# Altium schematic sheet RCJ_OnStage2024_FC_mcu.SchDoc
size 891 x 420 mm; SheetNumber: 1; SheetTotal: 4; SheetSize: А3
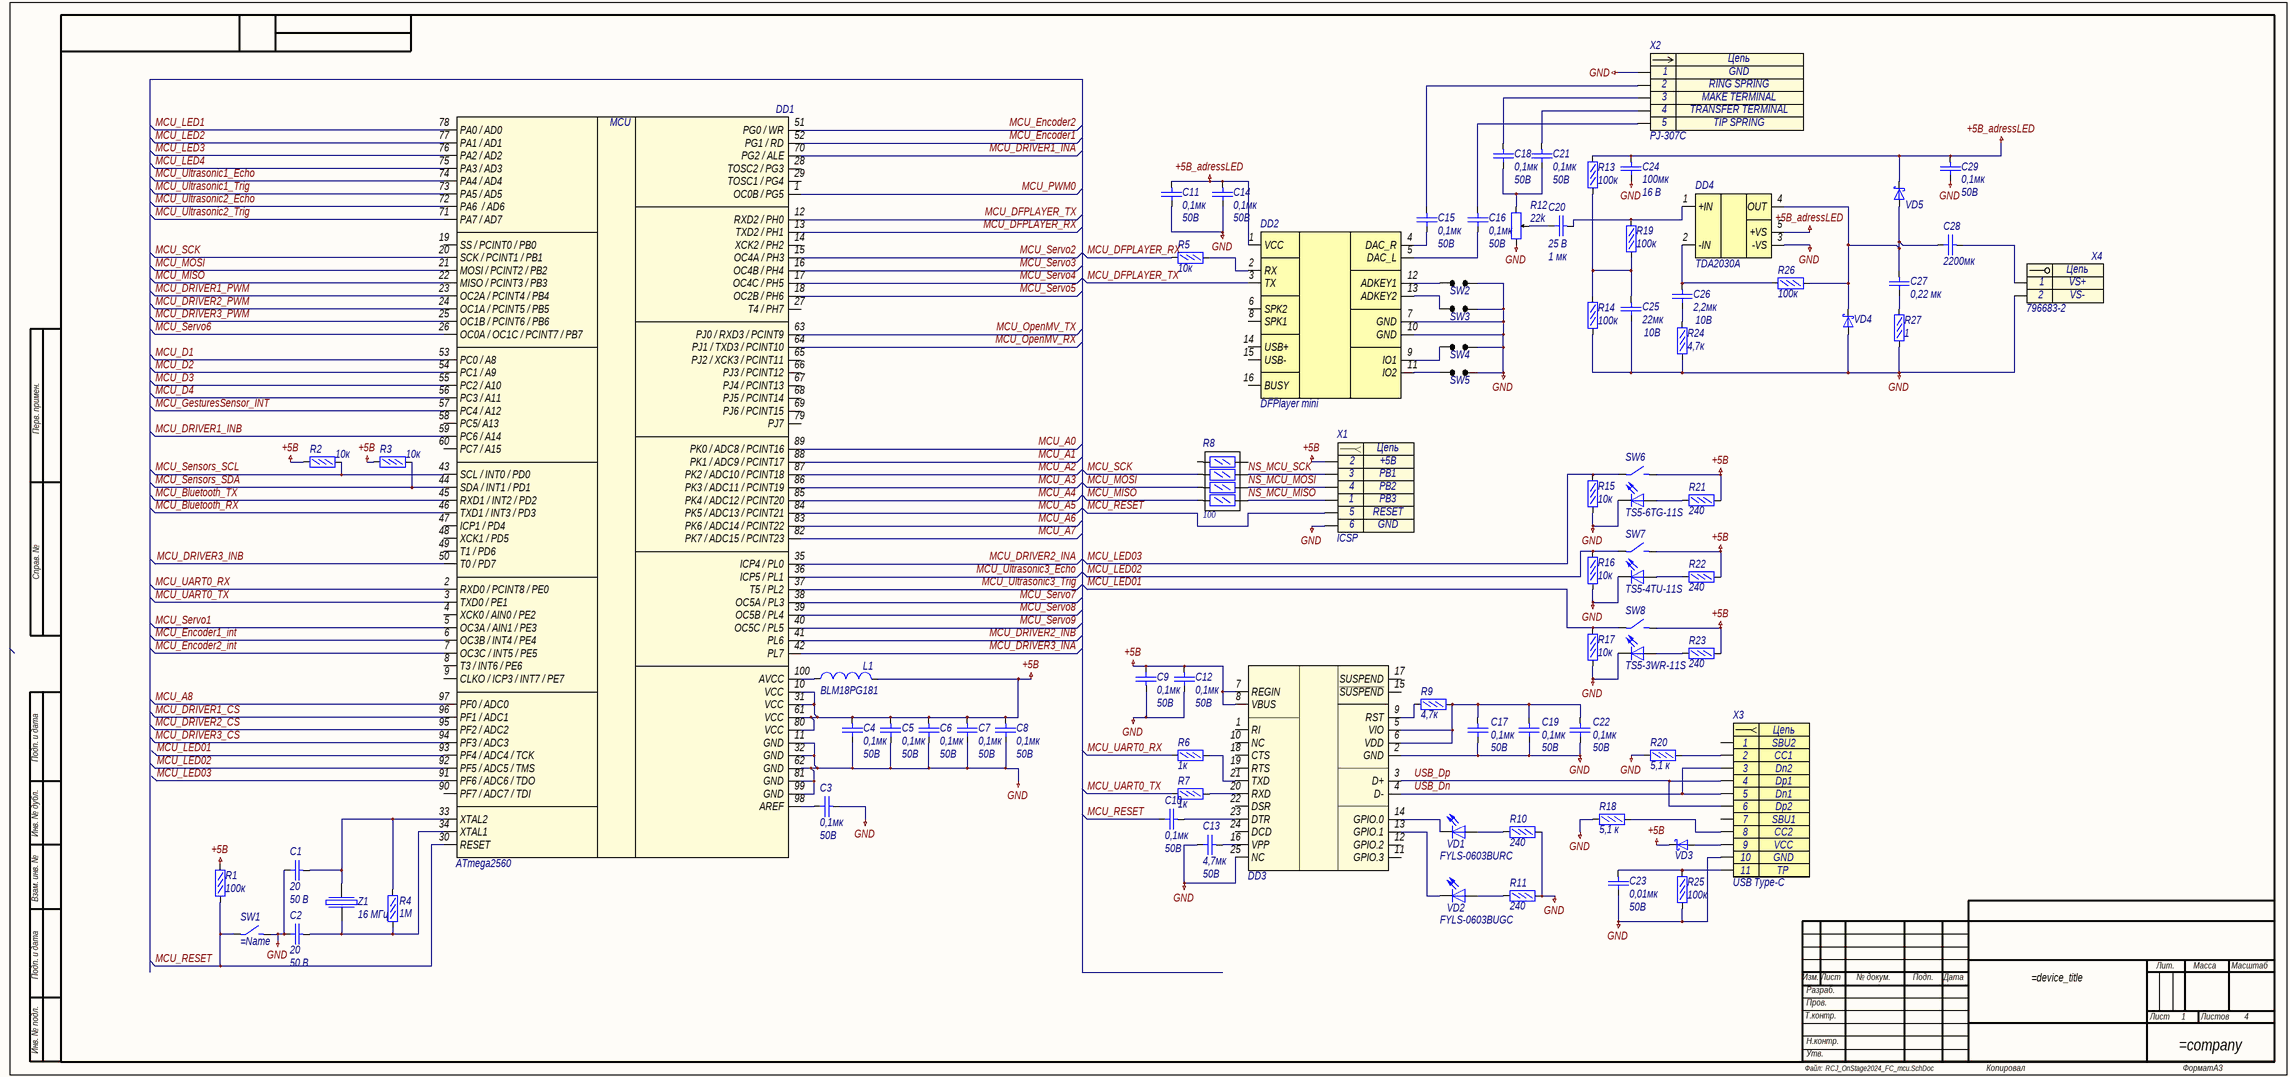
[diagram p0: RCJ_OnStage2024_FC_mcu.SchDoc]

## Parts
C1  20  Voltage: 50 В  [C0603]
C2  20  Voltage: 50 В  [C0603]
C3  0,1мк  Voltage: 50В  [C0603]
C4  0,1мк  Voltage: 50В  [C0603]
C5  0,1мк  Voltage: 50В  [C0603]
C6  0,1мк  Voltage: 50В  [C0603]
C7  0,1мк  Voltage: 50В  [C0603]
C8  0,1мк  Voltage: 50В  [C0603]
C9  0,1мк  Voltage: 50В  [C0603]
C10  0,1мк  Voltage: 50В  [C0603]
C11  0,1мк  Voltage: 50В  [C0603]
C12  0,1мк  Voltage: 50В  [C0603]
C13  4,7мк  Voltage: 50В  [C1210]
C14  0,1мк  Voltage: 50В  [C0603]
C15  0,1мк  Voltage: 50В  [C0603]
C16  0,1мк  Voltage: 50В  [C0603]
C17  0,1мк  Voltage: 50В  [C0603]
C18  0,1мк  Voltage: 50В  [C0603]
C19  0,1мк  Voltage: 50В  [C0603]
C20  1 мк  [C0805]
C21  0,1мк  Voltage: 50В  [C0603]
C22  0,1мк  Voltage: 50В  [C0603]
C23  0,01мк  Voltage: 50В  [C0603]
C24  100мк  Voltage: 16 В  [C1210]
C25  22мк  Voltage: 10В  [C1210]
C26  2,2мк  Voltage: 10В  [C0603]
C27  0,22 мк  [C0805]
C28  2200мк  [C0603]
C29  0,1мк  Voltage: 50В  [C0603]
DD1  ATmega2560  [LQFP100]
DD2  DFPlayer mini  [MP3-TF-16P]
DD3  CP2104  [QFN-24]  (value not drawn)
DD4  TDA2030A  [TO-220-5B]
L1  BLM18PG181  [L0603]
R1  100к  [R0603]
R2  10к  [R0603]
R3  10к  [R0603]
R4  1М  [R0603]
R5  10к  [R0603]
R6  1к  [R0603]
R7  1к  [R0603]
R8  100  [R0603x4]
R9  4,7к  [R0603]
R10  240  [R0603]
R11  240  [R0603]
R12  22k  [RM065]
R13  100к  [R0603]
R14  100к  [R0603]
R15  10к  [R0603]
R16  10к  [R0603]
R17  10к  [R0603]
R18  5,1 к  [R0603]
R19  100к  [R0603]
R20  5,1 к  [R0603]
R21  240  [R0603]
R22  240  [R0603]
R23  240  [R0603]
R24  4,7к  [R0603]
R25  100к  [R0603]
R26  100к  [R0603]
R27  1  [R0603]
SW1  (no value)  [it-1187]
SW2  (no value)  [jumper]
SW3  (no value)  [jumper]
SW4  (no value)  [jumper]
SW5  (no value)  [jumper]
SW6  TS5-6TG-11S  [TS5]
SW7  TS5-4TU-11S  [TS5]
SW8  TS5-3WR-11S  [TS5]
VD1  FYLS-0603BURC  [LED0603_RED]
VD2  FYLS-0603BUGC  [LED0603_GREEN]
VD3  MBR140SFT1G  [SOD123]  (value not drawn)
VD4  MBR140SFT1G  [SOD123]  (value not drawn)
VD5  MBR140SFT1G  [SOD123]  (value not drawn)
X1  ICSP  [PLS-3x2]
X2  PJ-307C  [PJ-307C]
X3  USB Type-C  [USB4105-15-A-120]
X4  796683-2  [796683-2]
Z1  16 MГц  [QSMD3.2x2.5]

## Nets
+5В: C4.2 C5.2 C6.2 C7.2 C8.2 C9.1 C12.2 DD1.10(VCC) DD1.31(VCC) DD1.61(VCC) DD1.80(VCC) DD3.7(REGIN) DD3.8(VBUS) L1.2 R1.2 R2.1 R3.1 R21.2 R22.2 R23.2 SW6.4 SW7.4 SW8.4 VD3.1(K) X1.2
+5В_adressLED: C11.2 C14.2 C24.2 C29.2 DD2.1(VCC) DD4.5(+VS) R13.2 VD5.1(K)
GND: C1.1 C2.1 C3.2 C4.1 C5.1 C6.1 C7.1 C8.1 C9.2 C11.1 C12.1 C13.1 C14.1 C17.1 C19.1 C22.1 C23.1 C24.1 C25.1 C29.1 DD1.11(GND) DD1.32(GND) DD1.62(GND) DD1.81(GND) DD1.99(GND) DD2.7(GND) DD2.10(GND) DD3.2(GND) DD3.25(NC) DD4.3(-VS) R10.2 R11.2 R12.2 R14.1 R15.1 R16.1 R17.1 R18.1 R20.1 R24.1 R25.1 R27.1 SW1.2 SW2.2 SW3.2 SW4.2 SW5.2 SW6.5 SW7.5 SW8.5 VD4.2(A) X1.6 X2.1 X3.10(VCC) X4.2
MCU_A0: DD1.89(PK0_/_ADC8_/_PCINT16)
MCU_A1: DD1.88(PK1_/_ADC9_/_PCINT17)
MCU_A2: DD1.87(PK2_/_ADC10_/_PCINT18)
MCU_A3: DD1.86(PK3_/_ADC11_/_PCINT19)
MCU_A4: DD1.85(PK4_/_ADC12_/_PCINT20)
MCU_A5: DD1.84(PK5_/_ADC13_/_PCINT21)
MCU_A6: DD1.83(PK6_/_ADC14_/_PCINT22)
MCU_A7: DD1.82(PK7_/_ADC15_/_PCINT23)
MCU_A8: DD1.97(PF0_/_ADC0)
MCU_Bluetooth_RX: DD1.46(TXD1_/_INT3_/_PD3)
MCU_Bluetooth_TX: DD1.45(RXD1_/_INT2_/_PD2)
MCU_D1: DD1.53(PC0_/_A8)
MCU_D2: DD1.54(PC1_/_A9)
MCU_D3: DD1.55(PC2_/_A10)
MCU_D4: DD1.56(PC3_/_A11)
MCU_DFPLAYER_RX: DD1.13(TXD2_/_PH1) R5.1
MCU_DFPLAYER_TX: DD1.12(RXD2_/_PH0) DD2.3(TX)
MCU_DRIVER1_CS: DD1.96(PF1_/_ADC1)
MCU_DRIVER1_INA: DD1.70(PG2_/_ALE)
MCU_DRIVER1_INB: DD1.59(PC6_/_A14)
MCU_DRIVER1_PWM: DD1.23(OC2A_/_PCINT4_/_PB4)
MCU_DRIVER2_CS: DD1.95(PF2_/_ADC2)
MCU_DRIVER2_INA: DD1.35(ICP4_/_PL0)
MCU_DRIVER2_INB: DD1.41(PL6)
MCU_DRIVER2_PWM: DD1.24(OC1A_/_PCINT5_/_PB5)
MCU_DRIVER3_CS: DD1.94(PF3_/_ADC3)
MCU_DRIVER3_INA: DD1.42(PL7)
MCU_DRIVER3_INB: DD1.50(T0_/_PD7)
MCU_DRIVER3_PWM: DD1.25(OC1B_/_PCINT6_/_PB6)
MCU_Encoder1: DD1.52(PG1_/_RD)
MCU_Encoder1_int: DD1.6(OC3B_/_INT4_/_PE4)
MCU_Encoder2: DD1.51(PG0_/_WR)
MCU_Encoder2_int: DD1.7(OC3C_/_INT5_/_PE5)
MCU_GesturesSensor_INT: DD1.57(PC4_/_A12)
MCU_LED1: DD1.78(PA0_/_AD0)
MCU_LED01: DD1.93(PF4_/_ADC4_/_TCK) R17.2 SW8.1
MCU_LED2: DD1.77(PA1_/_AD1)
MCU_LED02: DD1.92(PF5_/_ADC5_/_TMS) R16.2 SW7.1
MCU_LED3: DD1.76(PA2_/_AD2)
MCU_LED03: DD1.91(PF6_/_ADC6_/_TDO) R15.2 SW6.1
MCU_LED4: DD1.75(PA3_/_AD3)
MCU_MISO: DD1.22(MISO_/_PCINT3_/_PB3) R8.3
MCU_MOSI: DD1.21(MOSI_/_PCINT2_/_PB2) R8.5
MCU_OpenMV_RX: DD1.64(PJ1_/_TXD3_/_PCINT10)
MCU_OpenMV_TX: DD1.63(PJ0_/_RXD3_/_PCINT9)
MCU_PWM0: DD1.1(OC0B_/_PG5)
MCU_RESET: C10.1 DD1.30(RESET) R1.1 SW1.1 X1.5
MCU_SCK: DD1.20(SCK_/_PCINT1_/_PB1) R8.7
MCU_Sensors_SCL: DD1.43(SCL_/_INT0_/_PD0) R2.2
MCU_Sensors_SDA: DD1.44(SDA_/_INT1_/_PD1) R3.2
MCU_Servo1: DD1.5(OC3A_/_AIN1_/_PE3)
MCU_Servo2: DD1.15(OC4A_/_PH3)
MCU_Servo3: DD1.16(OC4B_/_PH4)
MCU_Servo4: DD1.17(OC4C_/_PH5)
MCU_Servo5: DD1.18(OC2B_/_PH6)
MCU_Servo6: DD1.26(OC0A_/_OC1C_/_PCINT7_/_PB7)
MCU_Servo7: DD1.38(OC5A_/_PL3)
MCU_Servo8: DD1.39(OC5B_/_PL4)
MCU_Servo9: DD1.40(OC5C_/_PL5)
MCU_UART0_RX: DD1.2(RXD0_/_PCINT8_/_PE0) R6.1
MCU_UART0_TX: DD1.3(TXD0_/_PE1) R7.1
MCU_Ultrasonic1_Echo: DD1.74(PA4_/_AD4)
MCU_Ultrasonic1_Trig: DD1.73(PA5_/_AD5)
MCU_Ultrasonic2_Echo: DD1.72(PA6__/_AD6)
MCU_Ultrasonic2_Trig: DD1.71(PA7_/_AD7)
MCU_Ultrasonic3_Echo: DD1.36(ICP5_/_PL1)
MCU_Ultrasonic3_Trig: DD1.37(T5_/_PL2)
NS_MCU_MISO: R8.4 X1.1
NS_MCU_MOSI: R8.6 X1.4
NS_MCU_SCK: R8.8 X1.3
USB_Dn: DD3.4(D-) X3.3(B7) X3.5(A7)
USB_Dp: DD3.3(D+) X3.4(A6) X3.6(B6)
NetC1_2: C1.2 DD1.33(XTAL2) R4.2 Z1.2
NetC2_2: C2.2 DD1.34(XTAL1) R4.1 Z1.1
NetC3_1: C3.1 DD1.98(AREF)
NetC10_2: C10.2 DD3.23(DTR)
NetC13_2: C13.2 DD3.16(VPP)
NetC15_1: C15.1 DD2.4(DAC_R)
NetC15_2: C15.2 X2.2
NetC16_1: C16.1 DD2.5(DAC_L)
NetC16_2: C16.2 X2.5
NetC17_2: C17.2 C19.2 C22.2 DD3.5(VIO) DD3.6(VDD) R9.2
NetC18_1: C18.1 C21.1 R12.1
NetC18_2: C18.2 X2.3
NetC20_1: C20.1 R12.3
NetC20_2: C20.2 DD4.1(+IN) R19.2
NetC21_2: C21.2 X2.4
NetC23_2: C23.2 R25.2 X3.TP
NetC25_2: C25.2 R13.1 R14.2 R19.1
NetC26_1: C26.1 R24.2
NetC26_2: C26.2 DD4.2(-IN) R26.1
NetC27_1: C27.1 R27.2
NetC27_2: C27.2 C28.1 DD4.4(OUT) R26.2 VD4.1(K) VD5.2(A)
NetC28_2: C28.2 X4.1
NetDD1_100: DD1.100(AVCC) L1.1
NetDD2_2: DD2.2(RX) R5.2
NetDD2_9: DD2.9(IO1) SW4.1
NetDD2_11: DD2.11(IO2) SW5.1
NetDD2_12: DD2.12(ADKEY1) SW2.1
NetDD2_13: DD2.13(ADKEY2) SW3.1
NetDD3_9: DD3.9(RST) R9.1
NetDD3_13: DD3.13(GPIO.1) VD2.1(K)
NetDD3_14: DD3.14(GPIO.0) VD1.1(K)
NetDD3_20: DD3.20(RXD) R7.2
NetDD3_21: DD3.21(TXD) R6.2
NetR10_1: R10.1 VD1.2(A)
NetR11_1: R11.1 VD2.2(A)
NetR18_2: R18.2 X3.8(B5)
NetR20_2: R20.2 X3.2(A5)
NetR21_1: R21.1 SW6.6
NetR22_1: R22.1 SW7.6
NetR23_1: R23.1 SW8.6
NetVD3_2: VD3.2(A) X3.9(GND)

Not connected (* = marked no-connect by the designer): DD1 4(XCK0_/_AIN0_/_PE2) 8(T3_/_INT6_/_PE6) 9(CLKO_/_ICP3_/_INT7_/_PE7) 14(XCK2_/_PH2) 19(SS_/_PCINT0_/_PB0) 27(T4_/_PH7) 28(TOSC2_/_PG3) 29(TOSC1_/_PG4) 47(ICP1_/_PD4) 48(XCK1_/_PD5) 49(T1_/_PD6) 58(PC5/_A13) 60(PC7_/_A15) 65(PJ2_/_XCK3_/_PCINT11) 66(PJ3_/_PCINT12) 67(PJ4_/_PCINT13) 68(PJ5_/_PCINT14) 69(PJ6_/_PCINT15) 79(PJ7) 90(PF7_/_ADC7_/_TDI); DD2 6(SPK2) 8(SPK1) 14(USB+) 15(USB-) 16(BUSY); DD3 1(RI) 10(NC) 11(GPIO.3) 12(GPIO.2) 15(~{SUSPEND}) 17(SUSPEND) 18(CTS) 19(RTS) 22(DSR) 24(DCD); R8 1 2; X3 1(B8) 7(A8)

## Notes on the sheet
- Перв. примен.
- Справ. №
- Подп. и дата
- Инв. № дубл.
- Взам. инв. №
- Изм.
- Лист
- № докум.
- Подп.
- Дата
- Лит.
- Масса
- Масштаб
- Т.контр.
- Пров.
- Разраб.
- Листов
- Инв. № подл.
- Н.контр.
- Файл:
- Утв.
- Копировал
- Формат
- (in symbol 796683-2) Цепь
- (in symbol ATmega2560) MCU
- (in symbol CC0805KKX7R8BB105) 25 В
- (in symbol ICSP) Цепь
- (in symbol PJ-307C) Цепь
- (in symbol USB4105) Цепь; 11

## Library data of the parts
C1 C2 = CC0603JRNPO9BN200: Конденсатор керамический 20пФ 50В; Value: 20
C3-C12 C14-C19 C21 C22 C29 = GRM188R71H104KA93D: Конденсатор кер. 0,1мкФ 50В X7R; Manufacturer: Murata; Name: GRM188R71H104KA93D; TKE: X7R; Value: 0,1мк
C13 = GRM32ER71H475KA88L: Конденсатор кер. 4,7мкФ 50В X7R; Manufacturer: Murata; Name: GRM32ER71H475KA88L; TKE: X7R; Value: 4,7мк
C20 = CC0805KKX7R8BB105: Конденсатор кер. 1мкФ 25В; Value: 1 мк
C23 = GRM188R71H103K: Конденсатор кер. 0,01мкФ 50В X7R; Manufacturer: Murata; TKE: X7R; Name: GRM188R71H103K; Value: 0,01мк
C24 = CC1210MKX5R7BB107: Конденсатор керамический 100мкФ 16В; Value: 100мк
C25 = GRM32ER61A226K: Конденсатор кер. 22мкФ 10В X5R; Manufacturer: Murata; Name: GRM32ER61A226K; TKE: X5R; Value: 22мк
C26 = GRM188R61A225K: Конденсатор кер. 2,2мкФ 10В X5R; Manufacturer: Murata; Name: GRM188R61A225K; TKE: X5R; Value: 2,2мк
C27 = CC0805JKX7R9BB224: Конденсатор кер. 0,22мкФ 50В; Value: 0,22 мк; Voltage: 50В
C28 = C0603: Конденсатор керамический 0603; Name: -; Manufacturer: -; TKE: -; Value: 2200мк; Voltage: -
DD1 = ATmega2560: Микроконтроллер; Name: ATmega2560
DD3 = CP2104: Преобразователь интерфейсов USB-UART; Name: CP2104
DD4 = TDA2030A: Усилитель звука; Name: TDA2030A
L1 = BLM18PG181: Ферритовая бусина; Manufacturer: Murata; Name: BLM18PG181
R1 R13 R14 R19 R25 R26 = RC0603FR-07100KL: Резистор 100кОм 0,063Вт 1%; Value: 100к
R2 R3 R5 R15-R17 = RC0603FR-0710KL: Резистор 10кОм 0,063Вт 1%; Manufacturer: YAGEO; Name: RC0603FR-0710KL; Tolerance: 1%; Value: 10к
R4 = RC0603FR-071ML: Резистор 1 МОм 0,063Вт 1%; Value: 1М
R6 R7 = RC0603FR-071KL: Резистор 1кОм 0,063Вт 1%; Manufacturer: YAGEO; Name: RC0603FR-071KL; Tolerance: 1%; Value: 1к
R8 = Резисторная сборка х4 0,125: Резисторы  0,125Вт; Value: 100
R9 R24 = RC0603FR-074K7L: Резистор 4,7кОм 0,063Вт 1%; Manufacturer: YAGEO; Name: RC0603FR-074K7L; Tolerance: 1%; Value: 4,7к
R10 R11 R21-R23 = RC0603FR-07240RL: Резистор 240Ом 0,063Вт 1%; Manufacturer: YAGEO; Name: RC0603FR-07240RL; Tolerance: 1%; Value: 240
R12 = RM065: Резистор переменный, 0.125 Вт, 20 кОм, 3-20, 20%; Value: 22k
R18 R20 = RC0603JR-075K1L: Резистор 5,1 кОм; Value: 5,1 к
R27 = RC0603FR-071RL: Резистор 1Ом 0,063Вт 1%; Manufacturer: YAGEO; Name: RC0603FR-071RL; Tolerance: 1%; Value: 1
SW1 = button
SW2-SW5 = Jumper: Запаиваемая перемычка
SW6 = TS5-6TG-11S: Миниатюрная кнопка с LED-подсветкой (зеленая); Name: TS5-6TG-11S
SW7 = TS5-4TU-11S: Миниатюрная кнопка с LED-подсветкой (синяя); Name: TS5-4TU-11S
SW8 = TS5-3WR-11S: Миниатюрная кнопка с LED-подсветкой (красная); Name: TS5-3WR-11S
VD1 VD2 = LED: Светодиод
  VD1: Name: FYLS-0603BURC
  VD2: Name: FYLS-0603BUGC
VD3-VD5 = MBR140SFT1G: Диод Шоттки 40В 1А; Name: MBR140SFT1G
X1 = ICSP: Разъем для программатора; Contact_1: +5B; Contact_2: PB1; Contact_3: PB2; Contact_4: PB3; Contact_5: RESET; Contact_6: GND; Name: ICSP
X2 = PJ-307C: Φ3.5mm, 3 poles, Audio Jack; Contact_1: GND; Contact_2: RING SPRING; Contact_3: MAKE TERMINAL; Contact_4: TRANSFER TERMINAL; Contact_5: TIP SPRING; Name: PJ-307C
X3 = USB4105: USB Type-C USB4105-GF-A / GCT; Contact_1: SBU2; Contact_2: CC1; Contact_3: Dn2; Contact_4: Dp1; Contact_5: Dn1; Contact_6: Dp2; Contact_7: SBU1; Contact_8: CC2; Contact_9: VCC; Contact_10: GND; Name: USB Type-C
X4 = 796683-2: Винтовой клеммник (наборный 2х2); Contact_1: VS+; Contact_2: VS-; Name: 796683-2
Z1 = QuartzCystal: Кварцевый резонатор; Value: 16 MГц
DD2 = DFPlayer mini: Name: DFPlayer mini